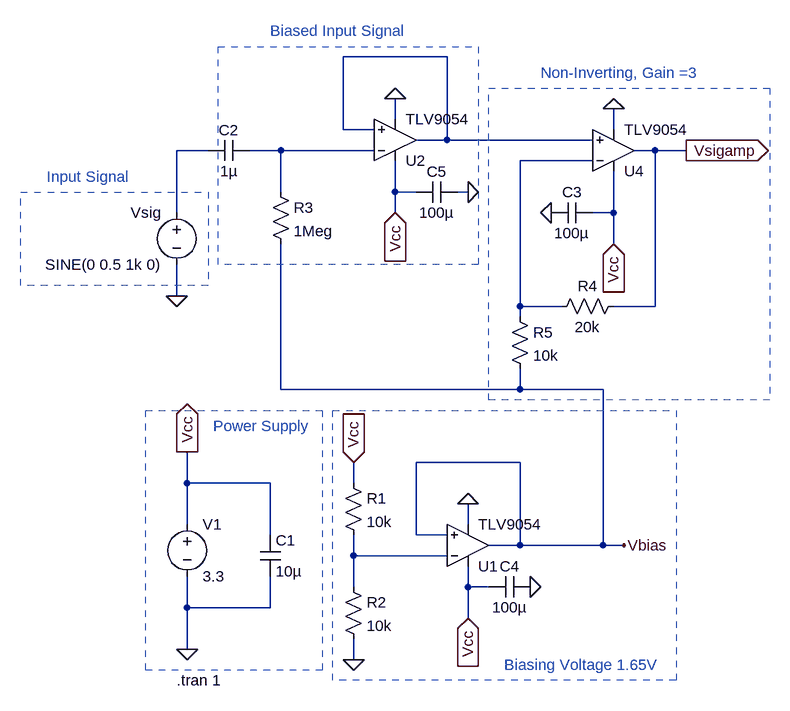
[diagram p0: schematic AFE.asc]
AFE.asc, the LTspice schematic file:
Version 4
SHEET 1 1216 1364
WIRE -384 -496 -544 -496
WIRE -464 -400 -464 -432
WIRE -544 -384 -544 -496
WIRE -496 -384 -544 -384
WIRE -128 -384 -128 -416
WIRE -384 -368 -384 -496
WIRE -384 -368 -432 -368
WIRE -160 -368 -384 -368
WIRE -752 -352 -800 -352
WIRE -640 -352 -688 -352
WIRE -496 -352 -640 -352
WIRE -64 -352 -96 -352
WIRE -16 -352 -64 -352
WIRE -160 -336 -272 -336
WIRE -640 -288 -640 -352
WIRE -464 -288 -464 -336
WIRE -432 -288 -464 -288
WIRE -352 -288 -368 -288
WIRE -800 -256 -800 -352
WIRE -464 -256 -464 -288
WIRE -128 -256 -128 -320
WIRE -128 -256 -160 -256
WIRE -128 -208 -128 -256
WIRE -800 -128 -800 -176
WIRE -272 -112 -272 -336
WIRE -208 -112 -272 -112
WIRE -64 -112 -64 -352
WIRE -64 -112 -128 -112
WIRE -272 -96 -272 -112
WIRE -640 16 -640 -208
WIRE -272 16 -272 -16
WIRE -272 16 -640 16
WIRE -144 16 -272 16
WIRE -272 128 -432 128
WIRE -784 160 -784 112
WIRE -656 160 -784 160
WIRE -528 160 -528 128
WIRE -784 224 -784 160
WIRE -352 224 -352 192
WIRE -656 240 -656 160
WIRE -432 240 -432 128
WIRE -384 240 -432 240
WIRE -272 256 -272 128
WIRE -272 256 -320 256
WIRE -144 256 -144 16
WIRE -144 256 -272 256
WIRE -112 256 -144 256
WIRE -528 272 -528 240
WIRE -384 272 -528 272
WIRE -528 320 -528 272
WIRE -352 320 -352 288
WIRE -320 320 -352 320
WIRE -784 352 -784 304
WIRE -656 352 -656 304
WIRE -656 352 -784 352
WIRE -352 368 -352 320
WIRE -784 416 -784 352
WIRE -528 432 -528 400
FLAG -528 432 0
FLAG -528 128 Vcc
IOPIN -528 128 In
FLAG -784 416 0
FLAG -784 112 Vcc
IOPIN -784 112 Out
FLAG -352 368 Vcc
IOPIN -352 368 In
FLAG -464 -256 Vcc
IOPIN -464 -256 In
FLAG -352 192 0
FLAG -464 -432 0
FLAG -128 -208 Vcc
IOPIN -128 -208 In
FLAG -800 -128 0
FLAG -16 -352 Vsigamp
IOPIN -16 -352 Out
FLAG -224 -256 0
FLAG -256 320 0
FLAG -352 -288 0
FLAG -128 -416 0
FLAG -112 256 Vbias
SYMBOL res -544 144 R0
SYMATTR InstName R1
SYMATTR Value 10k
SYMBOL res -544 304 R0
SYMATTR InstName R2
SYMATTR Value 10k
SYMBOL voltage -784 208 R0
WINDOW 123 0 0 Left 0
WINDOW 39 0 0 Left 0
SYMATTR InstName V1
SYMATTR Value 3.3
SYMBOL cap -672 240 R0
SYMATTR InstName C1
SYMATTR Value 10µ
SYMBOL voltage -800 -272 M0
WINDOW 123 0 0 Left 0
WINDOW 39 0 0 Left 0
SYMATTR InstName Vsig
SYMATTR Value SINE(0 0.5 1k 0)
SYMBOL cap -688 -368 R90
WINDOW 0 0 32 VBottom 2
WINDOW 3 32 32 VTop 2
SYMATTR InstName C2
SYMATTR Value 1µ
SYMBOL res -656 -304 R0
SYMATTR InstName R3
SYMATTR Value 1Meg
SYMBOL TLV9054 -352 256 M180
SYMATTR InstName U1
SYMBOL TLV9054 -464 -368 M180
SYMATTR InstName U2
SYMBOL TLV9054 -128 -352 M180
SYMATTR InstName U4
SYMBOL res -112 -128 R90
WINDOW 0 0 56 VBottom 2
WINDOW 3 32 56 VTop 2
SYMATTR InstName R4
SYMATTR Value 20k
SYMBOL res -288 -112 R0
SYMATTR InstName R5
SYMATTR Value 10k
SYMBOL cap -224 -240 R270
WINDOW 0 32 32 VTop 2
WINDOW 3 0 32 VBottom 2
SYMATTR InstName C3
SYMATTR Value 100µ
SYMBOL cap -256 304 R90
WINDOW 0 0 32 VBottom 2
WINDOW 3 32 32 VTop 2
SYMATTR InstName C4
SYMATTR Value 100µ
SYMBOL cap -368 -272 M270
WINDOW 0 32 32 VTop 2
WINDOW 3 0 32 VBottom 2
SYMATTR InstName C5
SYMATTR Value 100µ
TEXT -800 464 Left 2 !.tran 1
TEXT -1000 -312 Left 2 ;Input Signal
TEXT -296 440 Left 2 ;Biasing Voltage 1.65V
TEXT -744 72 Left 2 ;Power Supply
TEXT -240 -472 Left 2 ;Non-Inverting, Gain =3
TEXT -656 -536 Left 2 ;Biased Input Signal
RECTANGLE Normal -752 -144 -1040 -288 3
RECTANGLE Normal -32 464 -560 48 3
RECTANGLE Normal -576 448 -848 48 3
RECTANGLE Normal 112 32 -320 -448 3
RECTANGLE Normal -336 -176 -736 -512 3

The netlist it stands for:
* AFE.asc
R1 Vcc N005 10k
R2 N005 0 10k
V1 Vcc 0 3.3
C1 Vcc 0 10µ
Vsig N002 0 SINE(0 0.5 1k 0)
C2 N003 N002 1µ
R3 N003 Vbias 1Meg
* U1: TLV9054 (symbol TLV9054 not available, pins judged from their places): In+=Vbias In-=N005 V+=Vcc V-=0 OUT=Vbias
* U2: TLV9054 (symbol TLV9054 not available, pins judged from their places): In+=N001 In-=N003 V+=Vcc V-=0 OUT=N001
* U4: TLV9054 (symbol TLV9054 not available, pins judged from their places): In+=N001 In-=N004 V+=Vcc V-=0 OUT=Vsigamp
R4 Vsigamp N004 20k
R5 N004 Vbias 10k
C3 0 Vcc 100µ
C4 0 Vcc 100µ
C5 0 Vcc 100µ
.tran 1
* Input Signal
* Biasing Voltage 1.65V
* Power Supply
* Non-Inverting, Gain =3
* Biased Input Signal
.backanno
.end